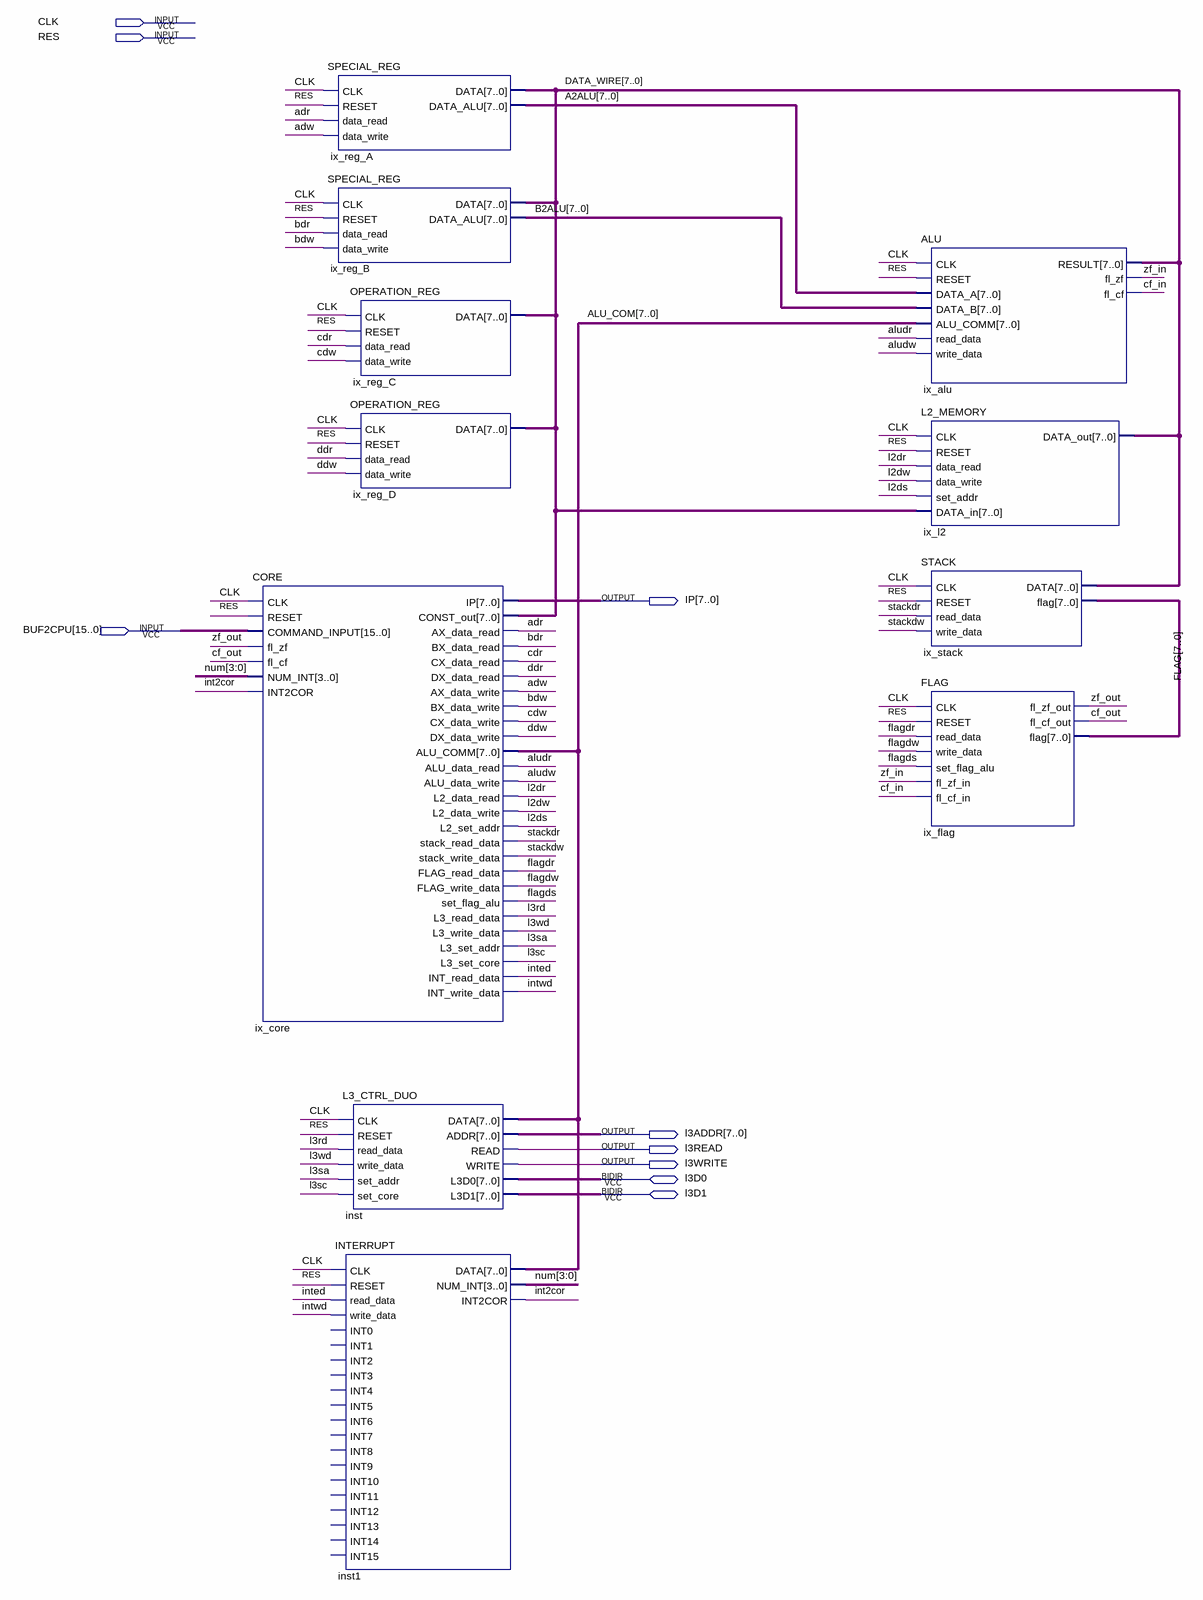
[diagram p0: schematic sheet]
// Quartus schematic MicroCPU.bdf as structural Verilog: 11 symbols, 9 pins
module MicroCPU (
  input  CLK,
  input  RES,
  input  [15:0] BUF2CPU,
  inout  l3D0,
  inout  l3D1,
  output [7:0] IP,
  output [7:0] l3ADDR,
  output l3READ,
  output l3WRITE
);

  wire adr, adw, aludr, aludw, bdr, bdw, cdr, cdw, cf_in, cf_out, ddr, ddw, flagdr, flagds, flagdw, int2cor,
       inted, intwd, l2dr, l2ds, l2dw, l3rd, l3sa, l3sc, l3wd, stackdr, stackdw, zf_in, zf_out;
  wire [3:0] num;
  wire [7:0] A2ALU, ALU_COM, B2ALU, DATA_WIRE, FLAG, inst_l3d0, inst_l3d1;

  CORE ix_core (
    .CLK(CLK), .RESET(RES), .COMMAND_INPUT(BUF2CPU), .fl_zf(zf_out), .fl_cf(cf_out), .NUM_INT(num),
    .INT2COR(int2cor), .IP(IP), .CONST_out(DATA_WIRE), .AX_data_read(adr), .BX_data_read(bdr),
    .CX_data_read(cdr), .DX_data_read(ddr), .AX_data_write(adw), .BX_data_write(bdw), .CX_data_write(cdw),
    .DX_data_write(ddw), .ALU_COMM(ALU_COM), .ALU_data_read(aludr), .ALU_data_write(aludw),
    .L2_data_read(l2dr), .L2_data_write(l2dw), .L2_set_addr(l2ds), .stack_read_data(stackdr),
    .stack_write_data(stackdw), .FLAG_read_data(flagdr), .FLAG_write_data(flagdw), .set_flag_alu(flagds),
    .L3_read_data(l3rd), .L3_write_data(l3wd), .L3_set_addr(l3sa), .L3_set_core(l3sc), .INT_read_data(inted),
    .INT_write_data(intwd));
  SPECIAL_REG ix_reg_A (.CLK(CLK), .RESET(RES), .data_read(adr), .data_write(adw), .DATA_ALU(A2ALU), .DATA(DATA_WIRE));
  SPECIAL_REG ix_reg_B (.CLK(CLK), .RESET(RES), .data_read(bdr), .data_write(bdw), .DATA_ALU(B2ALU), .DATA(DATA_WIRE));
  OPERATION_REG ix_reg_C (.CLK(CLK), .RESET(RES), .data_read(cdr), .data_write(cdw), .DATA(DATA_WIRE));
  OPERATION_REG ix_reg_D (.CLK(CLK), .RESET(RES), .data_read(ddr), .data_write(ddw), .DATA(DATA_WIRE));
  L3_CTRL_DUO inst (
    .CLK(CLK), .RESET(RES), .read_data(l3rd), .write_data(l3wd), .set_addr(l3sa), .set_core(l3sc),
    .ADDR(l3ADDR), .READ(l3READ), .WRITE(l3WRITE), .DATA(ALU_COM), .L3D0(inst_l3d0), .L3D1(inst_l3d1));
  INTERRUPT inst1 (
    .CLK(CLK), .RESET(RES), .read_data(inted), .write_data(intwd), .NUM_INT(num), .INT2COR(int2cor),
    .DATA(ALU_COM));  // open: INT0, INT1, INT2, INT3, INT4, INT5, INT6, INT7, INT8, INT9, INT10, INT11, INT12, INT13, INT14, INT15
  ALU ix_alu (
    .CLK(CLK), .RESET(RES), .DATA_A(A2ALU), .DATA_B(B2ALU), .ALU_COMM(ALU_COM), .read_data(aludr),
    .write_data(aludw), .RESULT(DATA_WIRE), .fl_zf(zf_in), .fl_cf(cf_in));
  L2_MEMORY ix_l2 (
    .CLK(CLK), .RESET(RES), .data_read(l2dr), .data_write(l2dw), .set_addr(l2ds), .DATA_in(DATA_WIRE),
    .DATA_out(DATA_WIRE));
  STACK ix_stack (.CLK(CLK), .RESET(RES), .read_data(stackdr), .write_data(stackdw), .DATA(DATA_WIRE), .flag(FLAG));
  FLAG ix_flag (
    .CLK(CLK), .RESET(RES), .read_data(flagdr), .write_data(flagdw), .set_flag_alu(flagds), .fl_zf_in(zf_in),
    .fl_cf_in(cf_in), .fl_zf_out(zf_out), .fl_cf_out(cf_out), .flag(FLAG));
endmodule
